# EAGLE design spider (EAGLE 6.3)
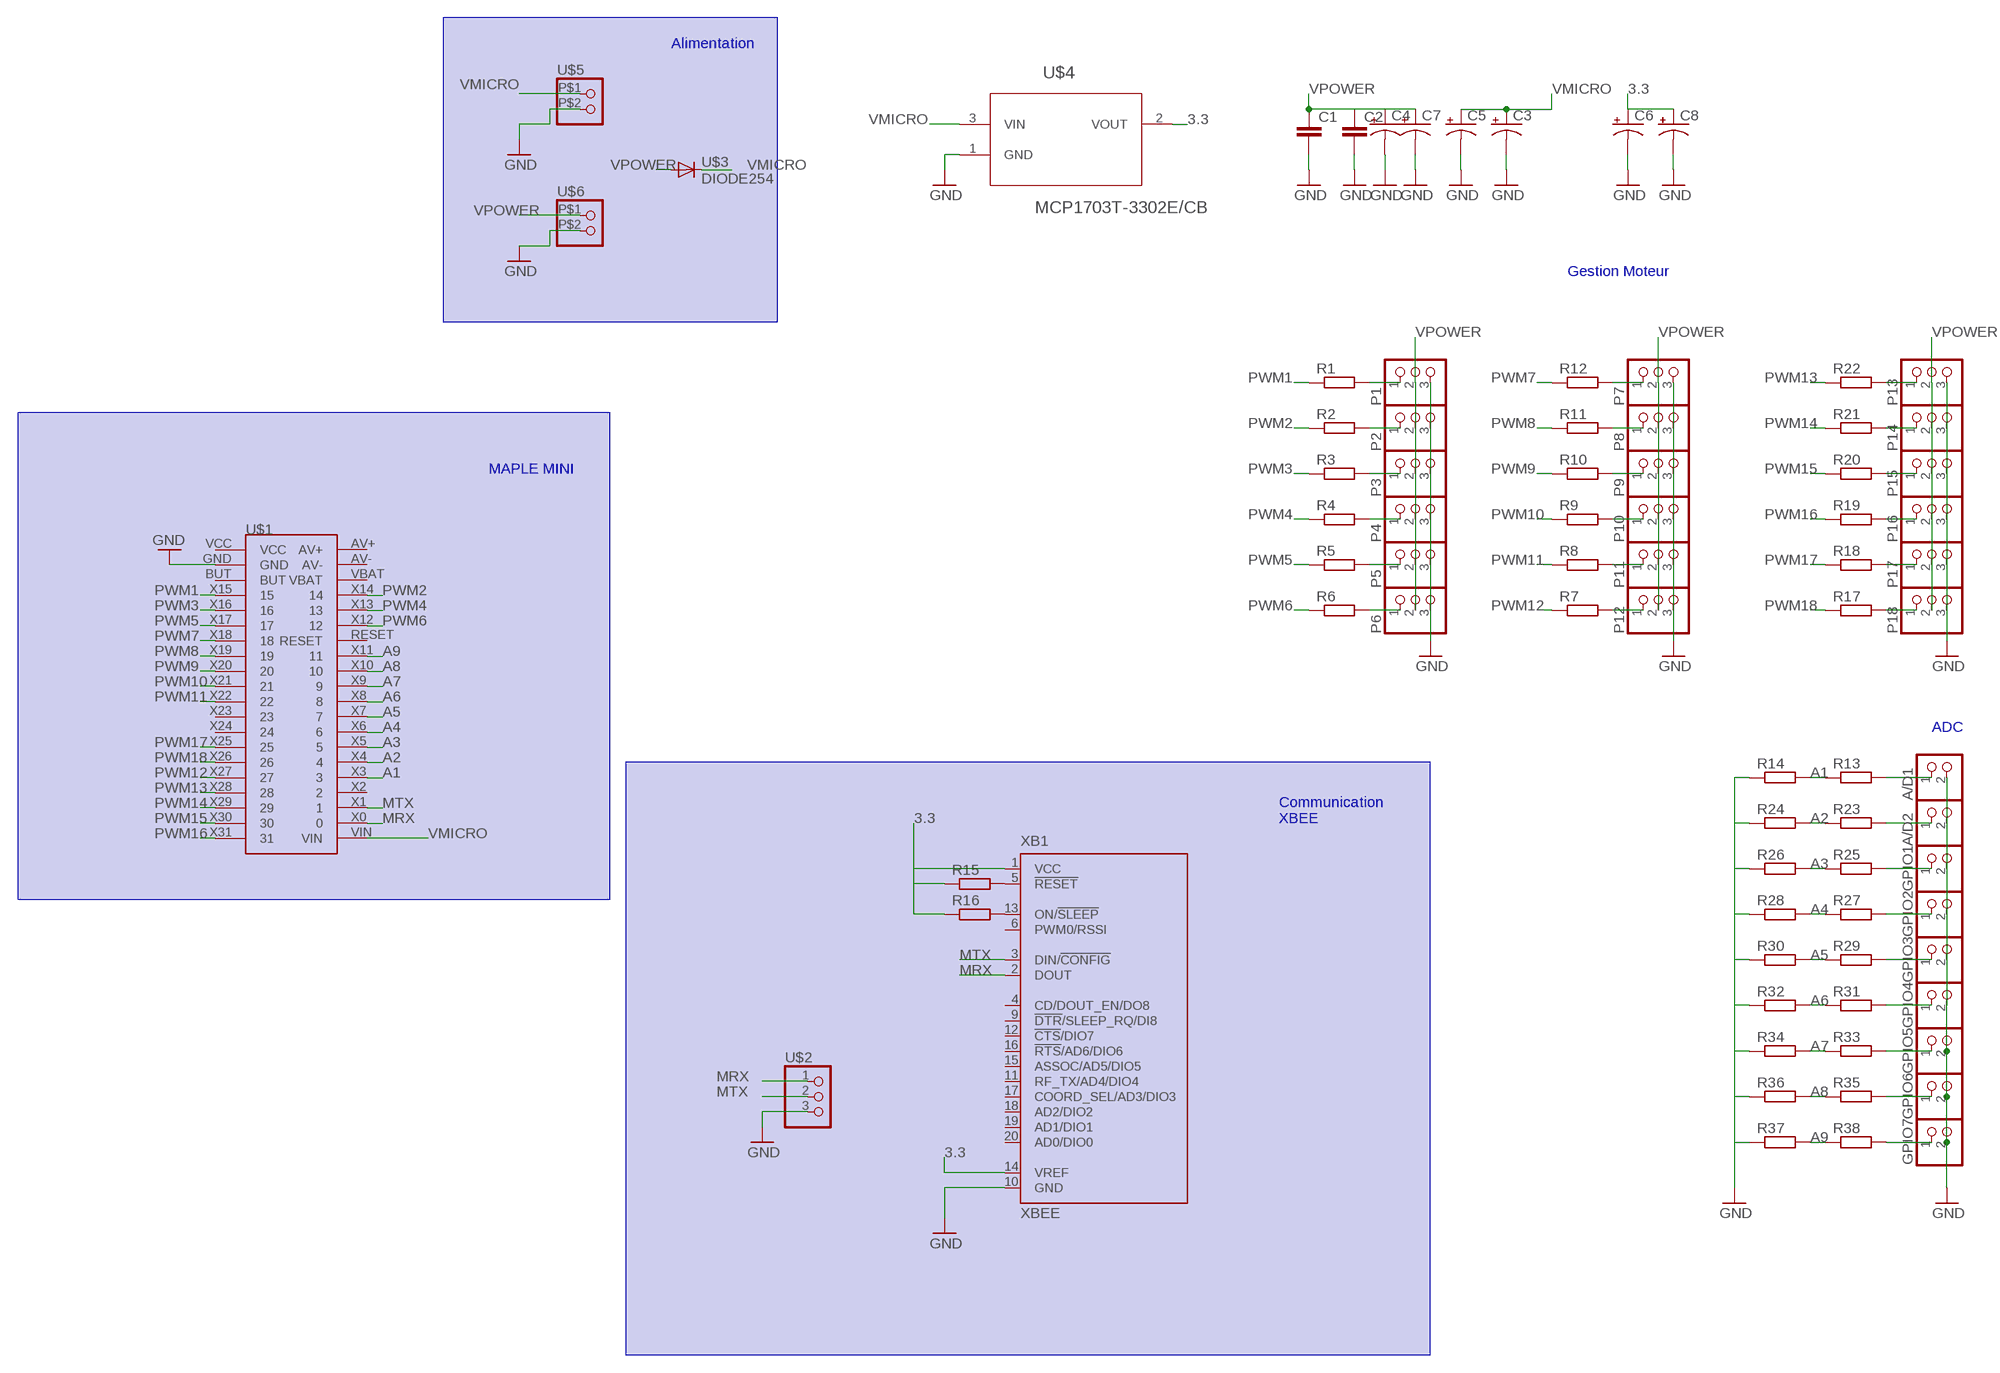
[diagram p0: schematic, sheet 1]

## Parts
A/D1  CONNEC_1X02  [CONNEC_1X02]
A/D2  CONNEC_1X02  [CONNEC_1X02]
C1  C-EU075-032X103  [C075-032X103]
C2  C-EU075-032X103  [C075-032X103]
C3  CAP_POLPTH2  [CPOL-RADIAL-10UF-25V]
C4  CAP_POLPTH2  [CPOL-RADIAL-10UF-25V]
C5  CAP_POLPTH2  [CPOL-RADIAL-10UF-25V]
C6  CAP_POLPTH2  [CPOL-RADIAL-10UF-25V]
C7  CAP_POLPTH2  [CPOL-RADIAL-10UF-25V]
C8  CAP_POLPTH2  [CPOL-RADIAL-10UF-25V]
GPIO1  CONNEC_1X02  [CONNEC_1X02]
GPIO2  CONNEC_1X02  [CONNEC_1X02]
GPIO3  CONNEC_1X02  [CONNEC_1X02]
GPIO4  CONNEC_1X02  [CONNEC_1X02]
GPIO5  CONNEC_1X02  [CONNEC_1X02]
GPIO6  CONNEC_1X02  [CONNEC_1X02]
GPIO7  CONNEC_1X02  [CONNEC_1X02]
P1  CONNEC_1X03  [CONNEC_1X03]
P2  CONNEC_1X03  [CONNEC_1X03]
P3  CONNEC_1X03  [CONNEC_1X03]
P4  CONNEC_1X03  [CONNEC_1X03]
P5  CONNEC_1X03  [CONNEC_1X03]
P6  CONNEC_1X03  [CONNEC_1X03]
P7  CONNEC_1X03  [CONNEC_1X03]
P8  CONNEC_1X03  [CONNEC_1X03]
P9  CONNEC_1X03  [CONNEC_1X03]
P10  CONNEC_1X03  [CONNEC_1X03]
P11  CONNEC_1X03  [CONNEC_1X03]
P12  CONNEC_1X03  [CONNEC_1X03]
P13  CONNEC_1X03  [CONNEC_1X03]
P14  CONNEC_1X03  [CONNEC_1X03]
P15  CONNEC_1X03  [CONNEC_1X03]
P16  CONNEC_1X03  [CONNEC_1X03]
P17  CONNEC_1X03  [CONNEC_1X03]
P18  CONNEC_1X03  [CONNEC_1X03]
R1  RESISTANCE-R0805  [R0805]
R2  RESISTANCE-R0805  [R0805]
R3  RESISTANCE-R0805  [R0805]
R4  RESISTANCE-R0805  [R0805]
R5  RESISTANCE-R0805  [R0805]
R6  RESISTANCE-R0805  [R0805]
R7  RESISTANCE-R0805  [R0805]
R8  RESISTANCE-R0805  [R0805]
R9  RESISTANCE-R0805  [R0805]
R10  RESISTANCE-R0805  [R0805]
R11  RESISTANCE-R0805  [R0805]
R12  RESISTANCE-R0805  [R0805]
R13  RESISTANCE-R0805  [R0805]
R14  RESISTANCE-R0805  [R0805]
R15  R-EU_R0805  [R0805]
R16  R-EU_R0805  [R0805]
R17  RESISTANCE-R0805  [R0805]
R18  RESISTANCE-R0805  [R0805]
R19  RESISTANCE-R0805  [R0805]
R20  RESISTANCE-R0805  [R0805]
R21  RESISTANCE-R0805  [R0805]
R22  RESISTANCE-R0805  [R0805]
R23  RESISTANCE-R0805  [R0805]
R24  RESISTANCE-R0805  [R0805]
R25  RESISTANCE-R0805  [R0805]
R26  RESISTANCE-R0805  [R0805]
R27  RESISTANCE-R0805  [R0805]
R28  RESISTANCE-R0805  [R0805]
R29  RESISTANCE-R0805  [R0805]
R30  RESISTANCE-R0805  [R0805]
R31  RESISTANCE-R0805  [R0805]
R32  RESISTANCE-R0805  [R0805]
R33  RESISTANCE-R0805  [R0805]
R34  RESISTANCE-R0805  [R0805]
R35  RESISTANCE-R0805  [R0805]
R36  RESISTANCE-R0805  [R0805]
R37  RESISTANCE-R0805  [R0805]
R38  RESISTANCE-R0805  [R0805]
U$1  MAPLE_MINI  [CONNEC_2X20]
U$2  CONNEC_1X03  [CONNEC_1X03]
U$3  DIODE254  [DIODE_254]
U$4  MCP1703T-3302E/CB  [SOT95P300X145-3N]
U$5  CONNEC_1X02BIG  [CONNEC_1X02_BIG]
U$6  CONNEC_1X02BIG  [CONNEC_1X02_BIG]
XB1  XBEE  [XBEE]

## Nets
3.3: C6.1(+) C8.1(+) R15.1 R16.1 U$4.2(VOUT) XB1.1(VCC) XB1.14(VREF)
A1: R13.1 R14.2 U$1.X3
A1P: A/D1.1 R13.2
A2: R23.1 R24.2 U$1.X4
A2P: A/D2.1 R23.2
A3: R25.1 R26.2 U$1.X5
A3P: GPIO1.1 R25.2
A4: R27.1 R28.2 U$1.X6
A4P: GPIO2.1 R27.2
A5: R29.1 R30.2 U$1.X7
A5P: GPIO3.1 R29.2
A6: R31.1 R32.2 U$1.X8
A6P: GPIO4.1 R31.2
A7: R33.1 R34.2 U$1.X9
A7P: GPIO5.1 R33.2
A8: R35.1 R36.2 U$1.X10
A8P: GPIO6.1 R35.2
A9: R37.2 R38.1 U$1.X11
GND [alime]: A/D1.2 A/D2.2 C1.2 C2.2 C3.2(-) C4.2(-) C5.2(-) C6.2(-) C7.2(-) C8.2(-) GPIO1.2 GPIO2.2 GPIO3.2 GPIO4.2 GPIO5.2 GPIO6.2 GPIO7.2 P1.3 P2.3 P3.3 P4.3 P5.3 P6.3 P7.3 P8.3 P9.3 P10.3 P11.3 P12.3 P13.3 P14.3 P15.3 P16.3 P17.3 P18.3 R14.1 R24.1 R26.1 R28.1 R30.1 R32.1 R34.1 R36.1 R37.1 U$1.GND U$2.3 U$4.1(GND) U$5.P$2 U$6.P$2 XB1.10(GND)
MRX: U$1.X0 U$2.1 XB1.2(DOUT)
MTX: U$1.X1 U$2.2 XB1.3(DIN/!CONFIG)
N$1: P1.1 R1.2
N$2: P2.1 R2.2
N$3: P3.1 R3.2
N$4: P4.1 R4.2
N$5: P5.1 R5.2
N$6: P6.1 R6.2
N$7: P12.1 R7.2
N$8: P11.1 R8.2
N$9: P10.1 R9.2
N$10: P9.1 R10.2
N$11: P8.1 R11.2
N$12: P7.1 R12.2
N$13: R15.2 XB1.5(!RESET)
N$14: P18.1 R17.2
N$15: R16.2 XB1.13(ON/!SLEEP)
N$16: P17.1 R18.2
N$17: P16.1 R19.2
N$18: P15.1 R20.2
N$19: P14.1 R21.2
N$20: P13.1 R22.2
N$40: GPIO7.1 R38.2
PWM1: R1.1 U$1.X15
PWM2: R2.1 U$1.X14
PWM3: R3.1 U$1.X16
PWM4: R4.1 U$1.X13
PWM5: R5.1 U$1.X17
PWM6: R6.1 U$1.X12
PWM7: R12.1 U$1.X18
PWM8: R11.1 U$1.X19
PWM9: R10.1 U$1.X20
PWM10: R9.1 U$1.X21
PWM11: R8.1 U$1.X22
PWM12: R7.1 U$1.X27
PWM13: R22.1 U$1.X28
PWM14: R21.1 U$1.X29
PWM15: R20.1 U$1.X30
PWM16: R19.1 U$1.X31
PWM17: R18.1 U$1.X25
PWM18: R17.1 U$1.X26
VMICRO [alime]: C3.1(+) C5.1(+) U$1.VIN U$3.B(C) U$4.3(VIN) U$5.P$1
VPOWER [alime]: C1.1 C2.1 C4.1(+) C7.1(+) P1.2 P2.2 P3.2 P4.2 P5.2 P6.2 P7.2 P8.2 P9.2 P10.2 P11.2 P12.2 P13.2 P14.2 P15.2 P16.2 P17.2 P18.2 U$3.A U$6.P$1
Unconnected: U$1.AV+ U$1.AV- U$1.BUT U$1.RESET U$1.VBAT U$1.VCC U$1.X2 U$1.X23 U$1.X24 XB1.4(CD/DOUT_EN/DO8) XB1.6(PWM0/RSSI) XB1.9(!DTR!/SLEEP_RQ/DI8) XB1.11(RF_TX/AD4/DIO4) XB1.12(!CTS!/DIO7) XB1.15(ASSOC/AD5/DIO5) XB1.16(!RTS!/AD6/DIO6) XB1.17(COORD_SEL/AD3/DIO3) XB1.18(AD2/DIO2) XB1.19(AD1/DIO1) XB1.20(AD0/DIO0)

## Notes on the sheet
- Alimentation
- Gestion Moteur
- MAPLE MINI
- ADC
- Communication
  XBEE

## Library data of the parts
A/D1 A/D2 GPIO1-GPIO7 = rhoban:CONNEC_1X02
C1 C2 = rcl:C-EU: CAPACITOR, European symbol
C3-C8 = SparkFun-Capacitors:CAP_POL: Capacitor Polarized These are standard SMD and PTH capacitors. Normally 10uF, 47uF, and 100uF in electrolytic and tantalum varieties. Always verify the external diameter of the through hole cap, it varies with capacity, voltage, and manufacturer. The EIA devices should be standard.
P1-P18 = rhoban:CONNEC_1X03
R1-R14 R17-R38 = rhoban:RESISTANCE: RESISTOR, European symbol
R15 R16 = rcl:R-EU_: RESISTOR, European symbol
U$1 = rhoban:MAPLE_MINI
U$2 = RobotCampus:CONNEC_1X03
U$3 = RobotCampus:DIODE254
U$4 = RobotCampus:MCP1703T-3302E/CB: Low Quiescent Current LDO Regulator; MPN: MCP1703T-3302E/CB; OC_FARNELL: 1439518; OC_NEWARK: 40M0637; PACKAGE: SOT-3; SUPPLIER: Microchip
U$5 U$6 = RobotCampus:CONNEC_1X02
XB1 = RobotCampus:XBEE: XBee (TM) /XBee-PRO(TM) OEM RF Modules Source: MaxStream, Inc. xbee_productmanual.pdf; MPN: XBP24-Z7UIT-004; OC_FARNELL: 1751799; OC_NEWARK: 34R5507

## Net classes
1 alime: width 1.016 mm

## Board
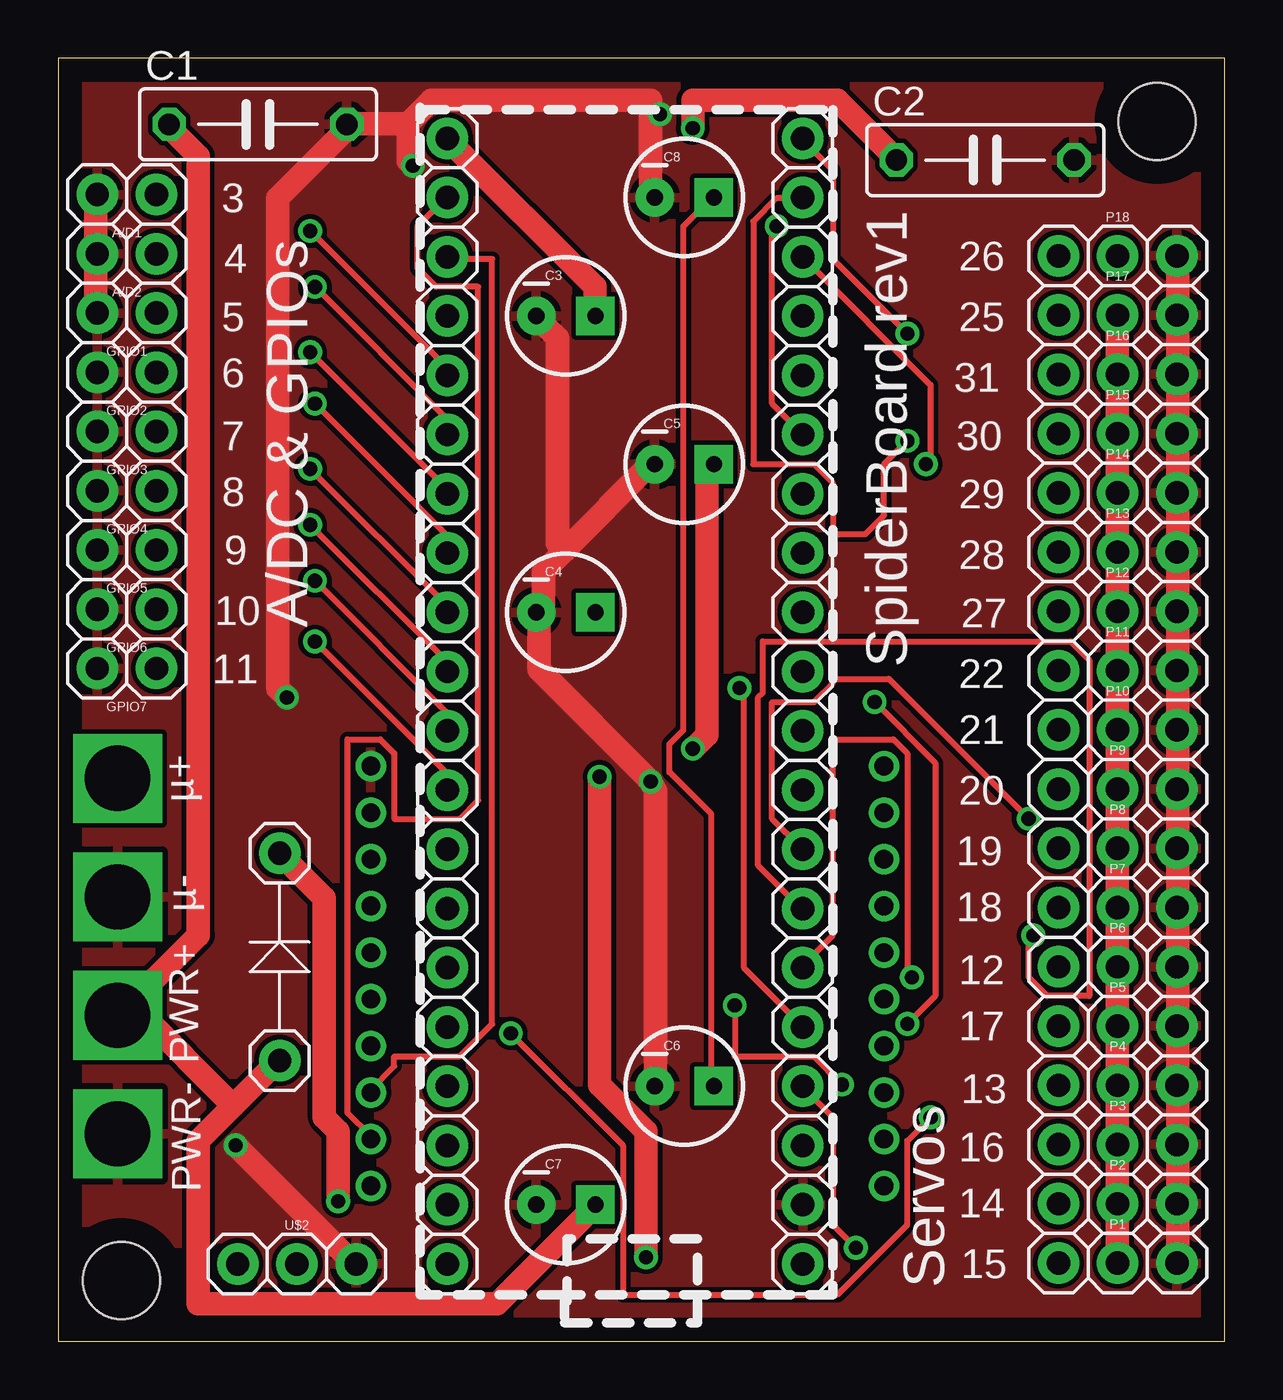
[diagram p1: board, top side]
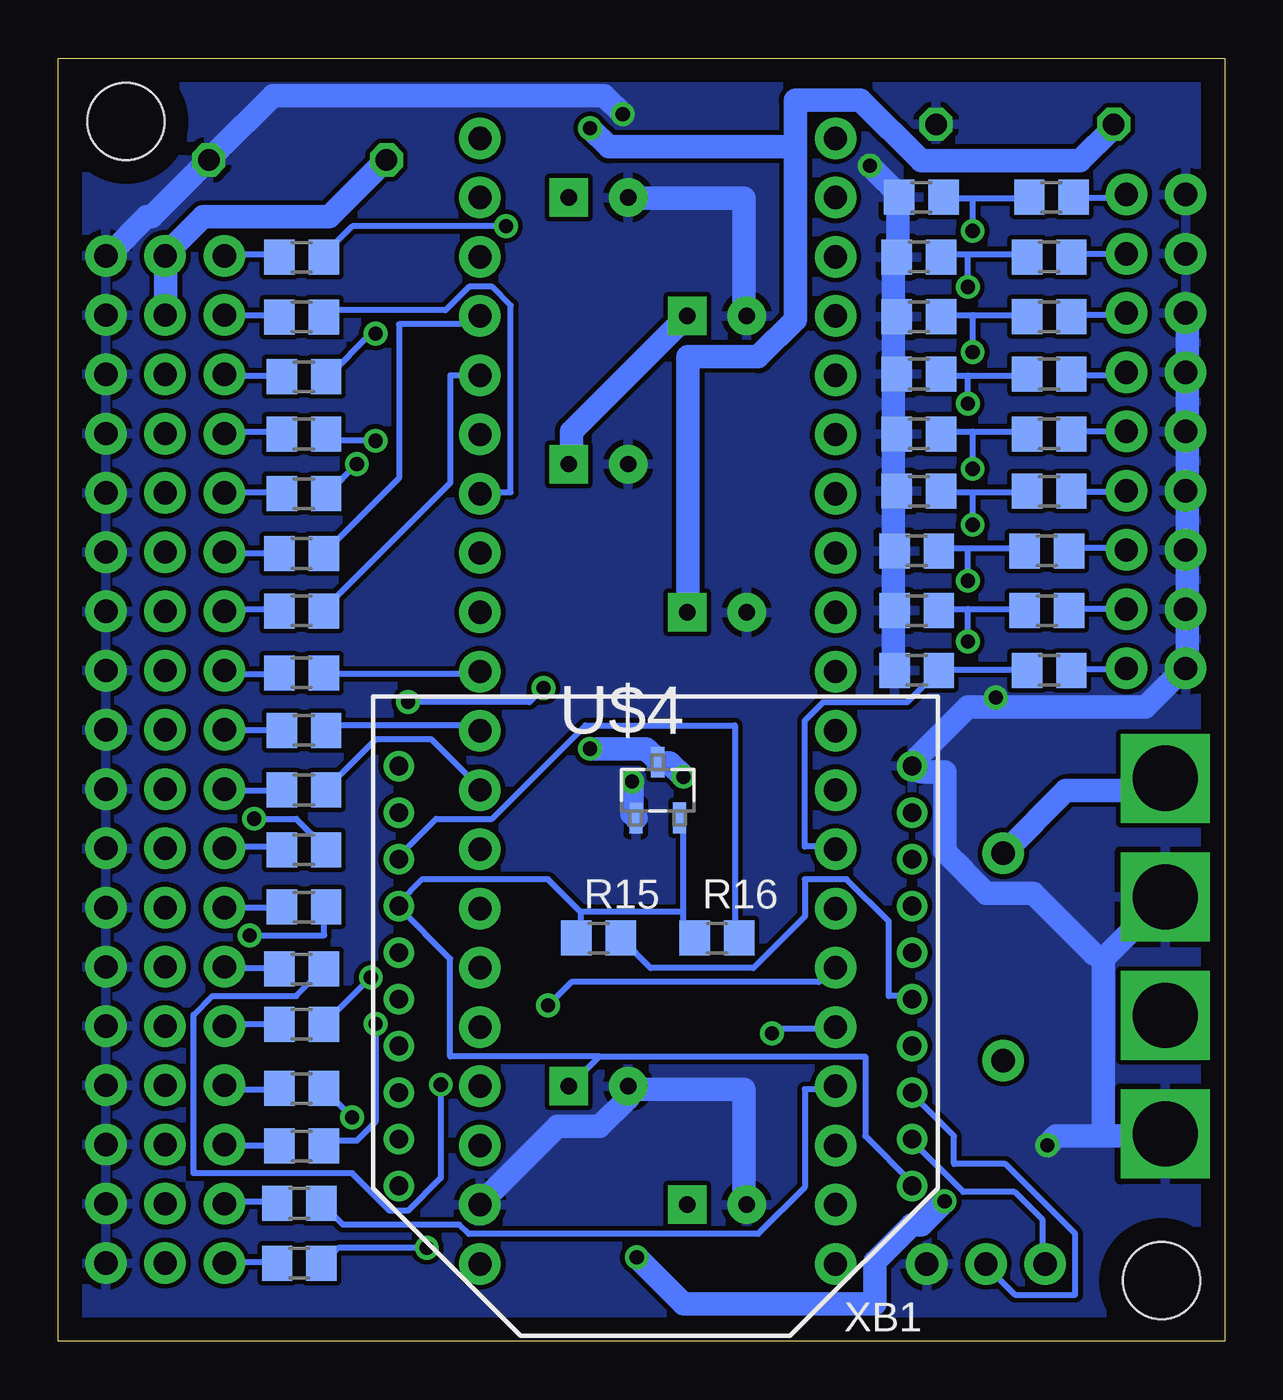
[diagram p2: board, bottom side, seen from below]

Size 50 x 55 mm. Coordinates in mm from the lower left corner, seen from the top.
Outline: 0,0 50,0 50,55 0,55 0,0
Copper layers (1*16): Top 0.035mm / dielectric 1.5mm / Bottom 0.035mm
Design rules "default": minimum track width 10mil, minimum drill 24mil, track to track 8mil, track to pad 8mil, pad to pad 8mil, via to via 8mil, smd to smd 8mil, copper to edge 40mil, drill to drill 8mil, minimum pad ring 10mil, minimum via ring 8mil, stop-mask expansion 4mil, vias tented up to drill 0mil, thermal gap 10mil

### Footprints (pad centres in the part's own frame; a part is rotated, then mirrored left to right if it is on the bottom)
CONNEC_1X02 = drill 1 pad 1.778: 1 -1.27,1.27; 2 1.27,1.27
C075-032X103 = drill 0.914 octagon: 1 -3.81,0; 2 3.81,0
CPOL-RADIAL-10UF-25V = drill 0.7 pad 1.651 square: 1 1.27,0 | drill 0.7 pad 1.651: 2 -1.27,0
CONNEC_1X03 = drill 1 pad 1.778: 1 -1.27,1.27; 2 1.27,1.27; 3 3.81,1.27
R0805 = smd 1.3 x 1.5: 1 -0.95,0; 2 0.95,0
CONNEC_2X20 = drill 1 pad 1.778: AV+ 0,0; AV- 2.54,0; BUT 5.08,-15.24; GND 2.54,-15.24; RESET 15.24,0; VBAT 5.08,0; VCC 0,-15.24; VIN 48.26,0; X0 45.72,0; X1 43.18,0; X2 40.64,0; X3 38.1,0; X4 35.56,0; X5 33.02,0; X6 30.48,0; X7 27.94,0; X8 25.4,0; X9 22.86,0; X10 20.32,0; X11 17.78,0; X12 12.7,0; X13 10.16,0; X14 7.62,0; X15 7.62,-15.24; X16 10.16,-15.24; X17 12.7,-15.24; X18 15.24,-15.24; X19 17.78,-15.24; X20 20.32,-15.24; X21 22.86,-15.24; X22 25.4,-15.24; X23 27.94,-15.24; X24 30.48,-15.24; X25 33.02,-15.24; X26 35.56,-15.24; X27 38.1,-15.24; X28 40.64,-15.24; X29 43.18,-15.24; X30 45.72,-15.24; X31 48.26,-15.24
DIODE_254 = drill 1 pad 1.778: A 0,0; B 8.89,0
SOT95P300X145-3N = smd 0.559 x 1.321: 1 -0.94,-1.194; 2 0.94,-1.194; 3 0,1.194
CONNEC_1X02_BIG = drill 2.8 square: P$1 0,0; P$2 5.08,0
STAND-OFF = hole 3.302: 0,0
XBEE = drill 0.8 pad 1.27: 1 -11,9; 2 -11,7; 3 -11,5; 4 -11,3; 5 -11,1; 6 -11,-1; 7 -11,-3; 8 -11,-5; 9 -11,-7; 10 -11,-9; 11 11,-9; 12 11,-7; 13 11,-5; 14 11,-3; 15 11,-1; 16 11,1; 17 11,3; 18 11,5; 19 11,7; 20 11,9

### Placement (x,y rotation side)
A/D1  2.94,50.43 180 top
A/D2  2.94,47.89 180 top
C1  8.56,52.17 0 top
C2  39.74,50.64 0 top
C3  21.76,43.95 0 top
C4  21.76,31.25 0 top
C5  26.84,37.6 0 top
C6  26.84,10.93 0 top
C7  21.76,5.85 0 top
C8  26.84,49.03 0 top
GPIO1  2.94,45.35 180 top
GPIO2  2.94,42.81 180 top
GPIO3  2.94,40.27 180 top
GPIO4  2.94,37.73 180 top
GPIO5  2.94,35.19 180 top
GPIO6  2.94,32.65 180 top
GPIO7  2.94,30.11 180 top
P1  44.15,2.08 0 top
P2  44.15,4.62 0 top
P3  44.15,7.16 0 top
P4  44.15,9.7 0 top
P5  44.15,12.24 0 top
P6  44.15,14.78 0 top
P7  44.15,17.32 0 top
P8  44.15,19.86 0 top
P9  44.15,22.4 0 top
P10  44.15,24.94 0 top
P11  44.15,27.48 0 top
P12  44.15,30.02 0 top
P13  44.15,32.56 0 top
P14  44.15,35.1 0 top
P15  44.15,37.64 0 top
P16  44.15,40.18 0 top
P17  44.15,42.72 0 top
P18  44.15,45.26 0 top
R1  39.67,3.35 180 bottom
R2  39.67,5.91 180 bottom
R3  39.57,8.37 180 bottom
R4  39.57,10.83 180 bottom
R5  39.57,13.59 180 bottom
R6  39.57,15.95 180 bottom
R7  39.57,31.31 180 bottom
R8  39.57,28.65 180 bottom
R9  39.47,26.19 180 bottom
R10  39.47,23.63 180 bottom
R11  39.47,21.07 180 bottom
R12  39.47,18.61 180 bottom
R13  7.42,49.04 0 bottom
R14  13,49.04 0 bottom
R15  26.84,17.28 0 bottom
R16  21.76,17.28 0 bottom
R17  39.57,46.47 180 bottom
R18  39.57,43.91 180 bottom
R19  39.47,41.35 180 bottom
R20  39.47,38.89 180 bottom
R21  39.47,36.33 180 bottom
R22  39.57,33.77 180 bottom
R23  7.52,46.48 0 bottom
R24  13.1,46.48 0 bottom
R25  7.52,43.92 0 bottom
R26  13.1,43.92 0 bottom
R27  7.52,41.46 0 bottom
R28  13.1,41.46 0 bottom
R29  7.52,38.9 0 bottom
R30  13.1,38.9 0 bottom
R31  7.52,36.44 0 bottom
R32  13.1,36.44 0 bottom
R33  7.62,33.88 0 bottom
R34  13.2,33.88 0 bottom
R35  7.62,31.32 0 bottom
R36  13.2,31.32 0 bottom
R37  13.2,28.76 0 bottom
R38  7.52,28.76 0 bottom
U$1  16.68,3.31 90 top
U$2  8.96,2.04 0 top
U$3  9.49,12.03 90 top
U$4  24.3,23.63 0 bottom
U$5  2.54,24.13 270 top
U$6  2.54,13.97 270 top
U$7  [STAND-OFF]  2.7,2.6 0 top
U$9  [STAND-OFF]  47.1,52.3 0 top
XB1  24.4,15.66 180 bottom

### Tracks (layer width: path | path; a pad name or v marks a point on that pad's centre or on a via)
3.3
  Top 0.254: C8.1 28,49 26.8,47.8 26.8,26.2 26.2,25.6 26.2,24.4 28,22.6 28,11 C6.1
  Bottom 0.254: 23.2,18.4 23.2,17.4 22.8,17.4 R16.1 | 23.2,18.4 23.2,22.4 U$4.2 | 27.6,18.4 27.6,17.4 R15.1 | 23.2,18.4 27.6,18.4 | 27.6,18.4 29,19.8 34.4,19.8 35.4,18.8 XB1.14 35.4,18.6 33.2,16.4 33.2,12.2 26.8,12.2 | 26.8,12.2 15.4,12.2 15.4,8.8 13.4,6.8 XB1.1 | 26.8,12.2 28,11 C6.1
A1  (via drill 0.61)
  Top 0.254: v10.8,47.6 16.6,41.8 16.6,41.6 U$1.X3
  Bottom 0.254: 10.8,49 12,49 R14.2 | 10.8,49 8.4,49 R13.1 | v10.8,47.6 10.8,49
A1P
  Bottom 0.254: R13.2 6.4,49 4.4,49 A/D1.1
A2  (via drill 0.61)
  Top 0.254: v11,45.2 16.6,39.6 16.6,39 U$1.X4
  Bottom 0.254: 11,46.6 12,46.6 R24.2 | 11,46.6 8.6,46.6 R23.1 | v11,45.2 11,46.6
A2P
  Bottom 0.254: R23.2 6.4,46.6 4.4,46.6 A/D2.1
A3  (via drill 0.61)
  Top 0.254: v10.8,42.4 16.6,36.6 16.6,36.4 U$1.X5
  Bottom 0.254: 10.8,44 12,44 R26.2 | 10.8,44 8.6,44 R25.1 | v10.8,42.4 10.8,44
A3P
  Bottom 0.254: R25.2 6.4,44 4.4,44 GPIO1.1
A4  (via drill 0.61)
  Top 0.254: v11,40.2 16.6,34.6 16.6,33.8 U$1.X6
  Bottom 0.254: 11,41.4 12,41.4 R28.2 | 11,41.4 8.6,41.4 R27.1 | v11,40.2 11,41.4
A4P
  Bottom 0.254: R27.2 6.4,41.4 4.4,41.4 GPIO2.1
A5  (via drill 0.61)
  Top 0.254: v10.8,37.4 16.6,31.6 16.6,31.4 U$1.X7
  Bottom 0.254: 10.8,39 12,39 R30.2 | 10.8,39 8.6,39 R29.1 | v10.8,37.4 10.8,39
A5P
  Bottom 0.254: GPIO3.1 6.4,39 R29.2
A6  (via drill 0.61)
  Top 0.254: v10.8,35 16.6,29.2 16.6,28.8 U$1.X8
  Bottom 0.254: 10.8,36.4 12,36.4 R32.2 | 10.8,36.4 8.6,36.4 R31.1 | v10.8,35 10.8,36.4
A6P
  Bottom 0.254: R31.2 6.4,36.4 4.4,36.4 GPIO4.1
A7  (via drill 0.61)
  Top 0.254: v11,32.6 16.6,27 16.6,26.2 U$1.X9
  Bottom 0.254: 11,34 12.2,34 R34.2 | 11,34 8.6,34 R33.1 | v11,32.6 11,34
A7P
  Bottom 0.254: R33.2 6.6,34 4.4,34 GPIO5.1
A8  (via drill 0.61)
  Top 0.254: v11,30 16.6,24.4 16.6,23.8 U$1.X10
  Bottom 0.254: 11,31.4 12.2,31.4 R36.2 | 11,31.4 8.6,31.4 R35.1 | v11,30 11,31.4
A8P
  Bottom 0.254: R35.2 6.6,31.4 4.4,31.4 GPIO6.1
A9
  Bottom 0.254: R38.1 8.6,28.8 12.2,28.8 R37.2 12.4,28.6 13.6,27.4 17.2,27.4 18,26.6 18,21.2 16.8,21.2 U$1.X11
GND  (via drill 0.61)
  Top 1.016: v7.6,8.4 12.6,3.4 U$2.3 | A/D1.2 1.6,49 1.6,46.8 A/D2.2 1.6,46.2 1.6,44.2 GPIO1.2 | P1.3 48,3.4 48,5.8 P2.3 48,6.4 48,8.4 P3.3 48,8.8 48,10.8 P4.3 48,11.4 48,13.4 P5.3 48,14 48,16 P6.3 48,16.4 48,18.4 P7.3 48,19 48,21 P8.3 48,21.6 48,23.6 P9.3 48,24 48,25.8 P10.3 48,26.4 48,28.6 P11.3 48,29.2 48,31.2 P12.3 48,31.8 48,33.8 P13.3 48,34.2 48,36.2 P14.3 48,36.8 48,38.8 P15.3 48,39.4 48,41.4 P16.3 48,41.8 48,43.8 P17.3 48,44.4 48,46.4 P18.3 | 15,52.2 12.4,52.2 C1.2 12.2,51.8 9.4,49 9.4,28 v9.8,27.6 | 15,52.2 16,53.2 25.4,53.2 25.4,52.6 | 25.4,52.6 25.4,49.2 C8.2 | v15.2,50.4 15,50.6 15,52.2 | 21.7,33.9 20.8,33 20.8,31.6 C4.2 20.6,31.2 20.6,28.8 v25.4,24 25.6,23.6 25.6,11 C6.2 | 21.7,33.9 25.4,37.6 C5.2 | C3.2 20.6,43.8 21.4,43 21.4,34.2 21.7,33.9 | v25.8,52.6 25.4,52.6
  Bottom 1.016: v7.6,8.4 7.2,8.8 5.2,8.8 | 5.2,8.8 2.6,8.8 U$6.P$2 | 5.2,16.4 2.6,19 U$5.P$2 | 5.2,8.8 5.2,16.4 | 9.8,27.2 3.4,27.2 1.8,28.8 GPIO7.2 1.6,29.2 1.6,31.2 GPIO6.2 1.6,31.8 1.6,33.8 GPIO5.2 1.6,34.4 1.6,36.4 GPIO4.2 1.6,36.8 1.6,39 GPIO3.2 1.6,39.4 1.6,41.4 GPIO2.2 1.6,42 1.6,44 GPIO1.2 | 9.8,27.2 11,27.2 13.4,24.8 XB1.10 13,24.4 12,24.4 12,21 10.2,19.2 8.2,19.2 5.6,16.6 5.2,16.4 | P18.3 47.8,46.6 46.2,48.2 46,48.2 43.6,50.6 C2.2 43.2,51 40.8,53.4 26.6,53.4 v25.8,52.6 | R37.1 14.2,28.8 14.2,31.2 R36.1 14.2,31.8 14.2,33.4 R34.1 14.2,34 14.2,36 R32.1 14.2,36.6 14.2,38.8 R30.1 14.2,39.4 14.2,41.4 R28.1 14.2,41.8 14.2,43.8 R26.1 14.2,44.4 14.2,46.4 R24.1 14,46.8 14,49 R14.1 14.2,49.4 v15.2,50.4 | C3.2 20.6,44 20.6,49 25.4,49 C8.2 | C7.2 20.6,6 20.6,10.8 25.4,10.8 C6.2 25.6,10.4 26.8,9.2 28.6,9.2 31.8,6 U$1.GND | v25.4,24 25.4,22.6 U$4.1 | v9.8,27.6 9.8,27.2
  pour Bottom: -4.7,70.3 -5.4,70.3 -5.4,-14.6 53.5,-14.6 53.5,68
  pour Top: -9,63.7 70.7,63.7 70.7,-11.7 -19.5,-11.7 -19.5,49.4
MRX
  Top 0.254: U$1.X0 16.6,49 15.4,47.8 15.4,46 16.2,45.2 18,45.2 18,23.2 17.2,22.4 14.4,22.4 14.4,25.2 13.8,25.8 12.4,25.8 12.4,9.8 13.4,8.8 XB1.2
  Bottom 0.254: XB1.2 13.4,8.6 11.2,6.4 9,6.4 7.8,5.2 7.8,3.4 U$2.1
MTX
  Top 0.254: U$1.X1 16.8,46.4 18.6,46.4 18.6,13.6 17.2,12.2 14.4,12.2 14.4,11.8 13.4,10.8 XB1.3
  Bottom 0.254: XB1.3 13.4,10.6 11.6,8.8 11.6,7.6 9.4,7.6 6.4,4.6 6.4,2 9,2 10.2,3.2 U$2.2
N$1
  Bottom 0.254: R1.2 40.8,3.4 42.8,3.4 P1.1
N$2
  Bottom 0.254: R2.2 40.8,6 42.8,6 P2.1
N$3
  Bottom 0.254: R3.2 40.6,8.4 42.8,8.4 P3.1
N$4
  Bottom 0.254: R4.2 40.6,10.8 42.8,10.8 P4.1
N$5
  Bottom 0.254: R5.2 40.6,13.6 42.8,13.6 P5.1
N$6
  Bottom 0.254: R6.2 40.6,16 42.8,16 P6.1
N$7
  Bottom 0.254: R7.2 40.6,31.4 42.8,31.4 P12.1
N$8
  Bottom 0.254: R8.2 40.6,28.6 42.8,28.6 P11.1
N$9
  Bottom 0.254: R9.2 40.6,26.2 42.8,26.2 P10.1
N$10
  Bottom 0.254: R10.2 40.6,23.6 42.8,23.6 P9.1
N$11
  Bottom 0.254: R11.2 40.6,21.2 42.8,21.2 P8.1
N$12
  Bottom 0.254: R12.2 40.6,18.6 42.8,18.6 P7.1
N$13
  Bottom 0.254: R15.2 25.8,17.2 24.6,16 20.2,16 18,18.2 18,19.8 16.2,19.8 14.4,18 14.4,14.8 13.4,14.8 XB1.5
N$14
  Bottom 0.254: R17.2 40.6,46.6 42.8,46.6 P18.1
N$15
  Bottom 0.254: R16.2 21,17.4 21,26.4 27.4,26.4 31.4,22.4 33.8,22.4 35.4,20.8 XB1.13
N$16
  Bottom 0.254: R18.2 40.6,44 42.8,44 P17.1
N$17
  Bottom 0.254: R19.2 40.6,41.4 42.8,41.4 P16.1
N$18
  Bottom 0.254: R20.2 40.6,39 42.8,39 P15.1
N$19
  Bottom 0.254: R21.2 40.6,36.4 42.8,36.4 P14.1
N$20
  Bottom 0.254: R22.2 40.6,33.8 42.8,33.8 P13.1
N$40
  Bottom 0.254: R38.2 6.4,28.8 4.4,28.8 GPIO7.1
PWM1  (via drill 0.61)
  Top 0.254: v34.2,4 33.2,5 33.2,9.6 32,10.8 U$1.X15
  Bottom 0.254: v34.2,4 38,4 38.6,3.4 R1.1
PWM2
  Bottom 0.254: R2.1 38.6,5.8 37.8,5 32.8,5 32.4,4.6 20,4.6 18,6.6 18,10.8 16.8,10.8 U$1.X14
PWM3  (via drill 0.61)
  Top 0.254: v36.4,13.6 37.6,14.8 37.6,24.8 v35,27.4 | v29.2,28 29.4,27.8 29.4,16 31.8,13.6 U$1.X16
  Bottom 0.254: v36.4,13.6 36.4,9.4 37.2,8.6 38.4,8.6 38.6,8.4 R3.1 | v35,27.4 29.8,27.4 v29.2,28
PWM4  (via drill 0.61)
  Top 0.254: v37.4,9.6 36.4,8.6 36.4,5 33.4,2 24.2,2 24.2,8.4 v19.4,13.2
  Bottom 0.254: v37.4,9.6 38.6,10.8 R4.1 | v19.4,13.2 19.2,13.4 16.8,13.4 U$1.X13
PWM5  (via drill 0.61)
  Top 0.254: v36.6,15.6 36.4,15.8 36.4,25.2 35.8,25.8 33.2,25.8 33.2,17.4 32,16.2 U$1.X17
  Bottom 0.254: v36.6,15.6 38.6,13.6 R5.1
PWM6  (via drill 0.61)
  Top 0.254: v33.6,11 32.4,12.2 29,12.2 v29,14.4
  Bottom 0.254: v33.6,11 33.6,7 35,5.6 35.8,5.6 37.4,7.2 44.2,7.2 44.2,14 43.4,14.8 39.8,14.8 38.8,15.8 R6.1 | v29,14.4 28,15.4 17.4,15.4 16.8,16 U$1.X12
PWM7  (via drill 0.61)
  Top 0.254: v41.8,17.4 41.6,17.2 41.6,15.6 42.4,14.8 44.2,14.8 44.2,29.2 43.4,30 30.2,30 30.2,27.8 30,27.6 30,20.4 31.8,18.6 U$1.X18
  Bottom 0.254: v41.8,17.4 38.6,17.4 38.6,18.6 R12.1
PWM8  (via drill 0.61)
  Top 0.254: v41.6,22.4 35.6,28.4 33.2,28.4 33.2,28.2 32.4,27.4 30.6,27.4 30.6,22.4 31.8,21.2 U$1.X19
  Bottom 0.254: v41.6,22.4 39.8,22.4 38.6,21.2 R11.1
PWM9
  Bottom 0.254: R10.1 38.4,23.8 36.4,25.8 34,25.8 32,23.8 U$1.X20
PWM10
  Bottom 0.254: R9.1 38.4,26.2 38.2,26.4 32.2,26.4 32,26.2 U$1.X21
PWM11
  Bottom 0.254: R8.1 38.6,28.6 32,28.6 U$1.X22
PWM12
  Bottom 0.254: R7.1 38.6,31.4 33.2,36.8 33.2,41.4 32,41.4 U$1.X27
PWM13
  Bottom 0.254: R22.1 38.6,33.8 35.4,37 35.4,43.6 32.2,43.6 32,43.8 U$1.X28
PWM14  (via drill 0.61)
  Top 0.254: v37.2,37.6 37.4,37.8 37.4,41 32,46.4 U$1.X29
  Bottom 0.254: v37.2,37.6 38.4,36.4 R21.1
PWM15  (via drill 0.61)
  Top 0.254: v36.4,38.6 35.4,37.6 35.4,35.4 34.6,34.6 33.2,34.6 33.2,36.8 32.4,37.6 29.8,37.6 29.8,48 30.8,49 31.8,49 U$1.X30
  Bottom 0.254: v36.4,38.6 38.2,38.6 38.4,38.8 R20.1
PWM16  (via drill 0.61)
  Top 0.254: v36.4,43.2 33.2,46.4 33.2,50.2 32,51.4 U$1.X31
  Bottom 0.254: v36.4,43.2 36.6,43.2 38.4,41.4 R19.1
PWM17
  Bottom 0.254: R18.1 38.6,44 38.4,44.2 33.4,44.2 32.4,45.2 31.4,45.2 30.6,44.4 30.6,36.4 31.8,36.4 U$1.X25
PWM18  (via drill 0.61)
  Top 0.254: v30.8,47.8 30.6,47.6 30.6,40.2 31.8,39 U$1.X26
  Bottom 0.254: v30.8,47.8 37.4,47.8 38.6,46.6 R17.1
VMICRO  (via drill 0.61)
  Top 1.016: v27.2,25.4 27.8,26 27.8,37.4 28,37.6 C5.1 | U$1.VIN 16.8,51.4 23,45.2 23,44 C3.1 | v12,6 12,9 11.4,9.6 11.4,19 9.6,20.8 U$3.B | v25.2,3.6 25.2,9 23.2,11 v23.2,24.2
  Bottom 1.016: U$3.B 9.4,21 6.8,23.6 3,23.6 2.6,24 U$5.P$1 | v27.2,25.4 24.8,25.4 24.4,25 U$4.3 23.8,24.8 v23.2,24.2 | C3.1 23.2,43.8 28,39 28,37.6 C5.1 | v12,6 13,5 13.4,5 15,3.4 15,1.6 23.2,1.6 v25.2,3.6
VPOWER  (via drill 0.61)
  Top 1.016: P1.2 45.4,3.4 45.4,5.8 P2.2 45.4,6.4 45.4,8.4 P3.2 45.4,8.8 45.4,10.8 P4.2 45.4,11.4 45.4,13.4 P5.2 45.4,14 45.4,16 P6.2 45.4,16.4 45.4,18.4 P7.2 45.4,19 45.4,21 P8.2 45.4,21.6 45.4,23.6 P9.2 45.4,24.2 45.4,26.2 P10.2 45.4,26.6 45.4,28.6 P11.2 45.4,29.2 45.4,31.2 P12.2 45.4,31.8 45.4,33.8 P13.2 45.4,34.2 45.4,36.2 P14.2 45.4,36.8 45.4,38.8 P15.2 45.4,39.4 45.4,41.4 P16.2 45.4,41.8 45.4,43.8 P17.2 | 7.5,10.1 9.4,12 U$3.A | 7.5,10.1 6,8.6 6,1.6 18.8,1.6 23,5.8 C7.1 | C1.1 4.8,52 6,50.8 6,17.4 2.6,14 U$6.P$1 3.4,14.2 7.5,10.1 | v27.2,52 27.2,53.2 33.4,53.2 35.8,50.8 C2.1
  Bottom 1.016: C2.1 36,50.6 38.4,48.2 43.8,48.2 45.4,46.6 P18.2 45.4,46 45.4,44 P17.2 | 18.4,51.2 18.4,53.2 15.6,53.2 13,50.6 6.2,50.6 4.8,52 C1.1 | 18.4,51.2 18.4,43.8 20,42.2 23,42.2 23,31.4 C4.1 | v27.2,52 26.4,51.2 18.4,51.2

### Text on the board
tNames: 3 | 4 | 26 | 5 | 25 | 6 | 31 | 7 | 30 | 8 | 29 | 9 | 28 | 10 | A/DC & GPIOs | 27 | SpiderBoard rev1 | 11 | 22 | 21 | µ+ | 20 | 19 | µ- | 18 | 12 | 17 | PWR+ | 13 | 16 | PWR- | 14 | 15 | Servos